# Altium schematic sheet LCD&Camera&Connectors.SchDoc: LCD & Camera & Connector
size A4; DocumentNumber: MB1167; Revision: B.1; SheetNumber: 6; SheetTotal: 17; Project: STM327x6G-EVAL
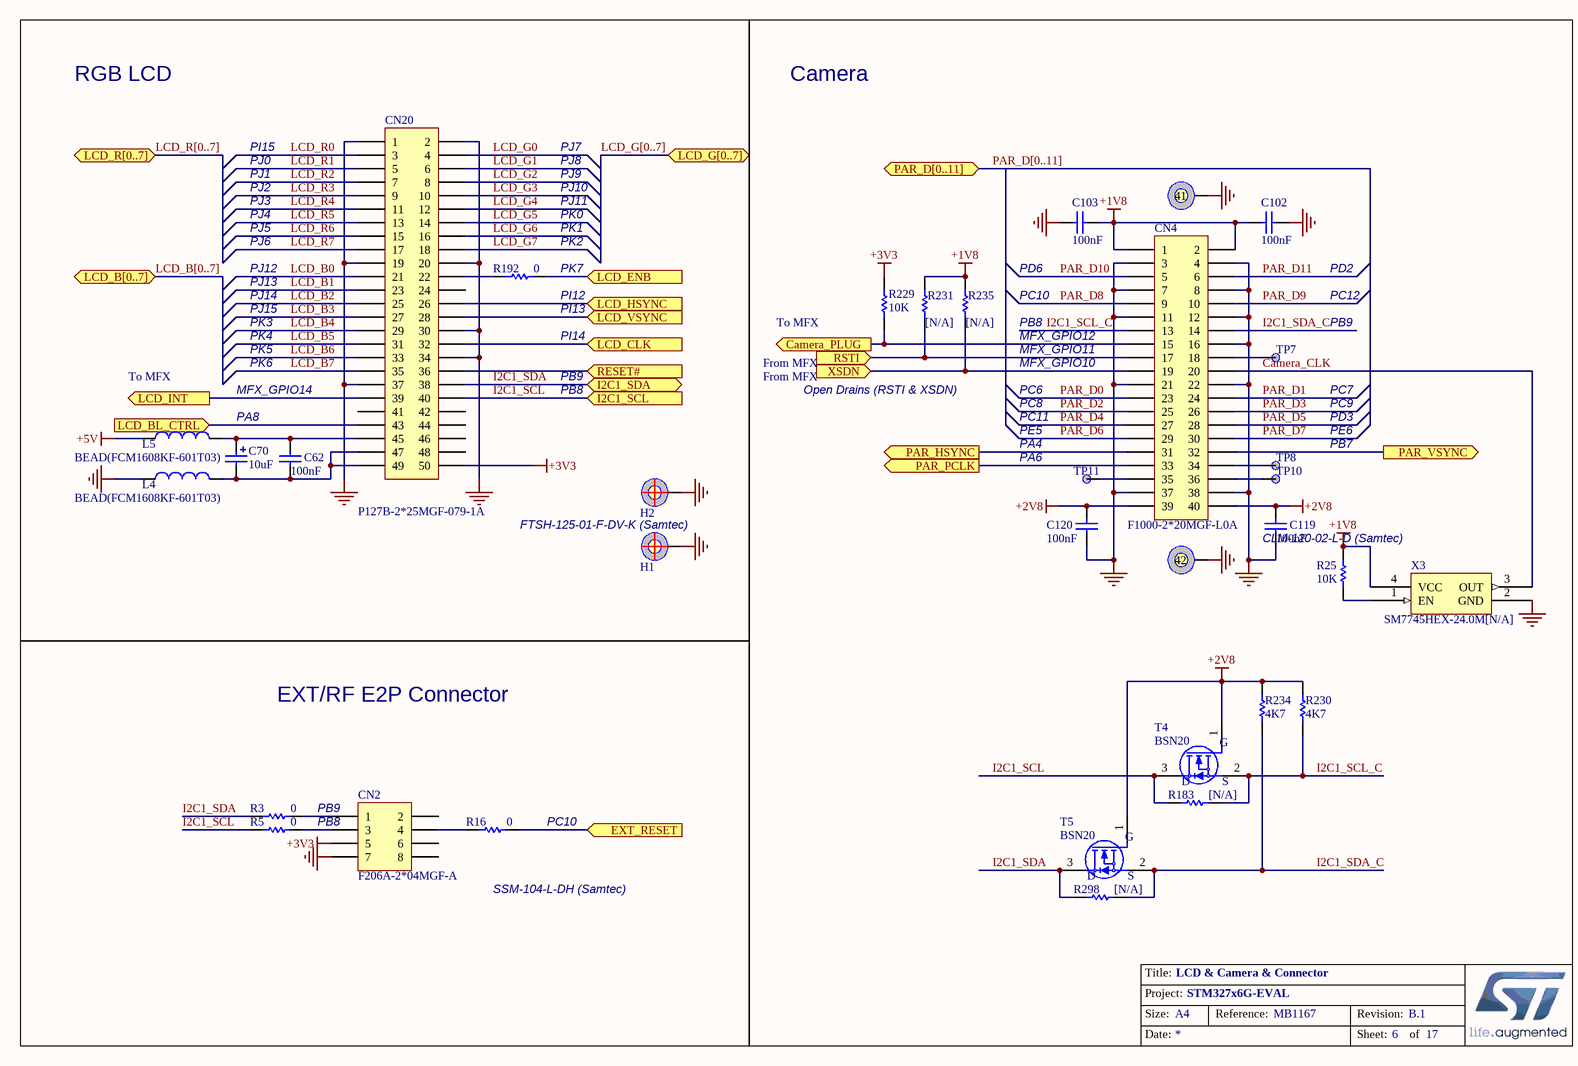
[diagram p0: LCD&Camera&Connectors.SchDoc]

## Parts
C62  100nF  [0603C]
C70  10uF  [TAN-A]
C102  100nF  [0603C]
C103  100nF  [0603C]
C119  100nF  [0603C]
C120  100nF  [0603C]
CN2  F206A-2*04MGF-A  [SSM-104-L-DH]
CN4  F1000-2*20MGF-L0A  [CLM-120-02-L-D]
CN20  P127B-2*25MGF-079-1A  [FTSH-125-01-F-DV]
H1  POSITION HOLE  [HOLE_C9D4R5]  (value not drawn)
H2  POSITION HOLE  [HOLE_C9D4R5]  (value not drawn)
L4  BEAD(FCM1608KF-601T03)  [0603L]
L5  BEAD(FCM1608KF-601T03)  [0603L]
R3  0  [0603R]
R5  0  [0603R]
R16  0  [0603R]
R25  10K  [0402R]
R183  [N/A]  [0603R]
R192  0  [0603R]
R229  10K  [0603R]
R230  4K7  [0603R]
R231  [N/A]  [0603R]
R234  4K7  [0603R]
R235  [N/A]  [0603R]
R298  [N/A]  [0603R]
T4  BSN20  [SOT-23]
T5  BSN20  [SOT-23]
TP7  (no value)  [TP]
TP8  (no value)  [TP]
TP10  (no value)  [TP]
TP11  (no value)  [TP]
X3  SM7745HEX-24.0M[N/A]  [OSC_4SM_7X5]

## Ports
Camera_PLUG (out), EXT_RESET (in), I2C1_SCL (in), I2C1_SDA (bidir), LCD_B[0..7] (bidir), LCD_BL_CTRL (in), LCD_CLK (in), LCD_ENB (in), LCD_G[0..7] (bidir), LCD_HSYNC (in), LCD_INT (out), LCD_R[0..7] (bidir), LCD_VSYNC (in), PAR_D[0..11] (bidir), PAR_HSYNC (out), PAR_PCLK (out), PAR_VSYNC (out), RESET# (in), RSTI (in), XSDN (in)

## Nets
+1V8: C102.1 C103.2 CN4.1 CN4.2 R25.2 R231.2 R235.2 X3.4(VCC)
+2V8: C119.1 C120.1 CN4.39 CN4.40 R230.2 R234.2 T4.1(G) T5.1(G)
+3V3: CN2.5 CN20.50 R229.1
+5V: L5.1
GND: C102.2 C103.1 C119.2 C120.2 CN2.7 CN4.3 CN4.4 CN4.7 CN4.8 CN4.11 CN4.12 CN4.16 CN4.21 CN4.22 CN4.37 CN4.38 CN4.41 CN4.42 CN20.1 CN20.2 CN20.19 CN20.20 CN20.30 CN20.34 CN20.37 H1.1 H2.1 L4.1 X3.2(GND)
Camera_CLK: CN4.20 X3.3(OUT)
Camera_PLUG: CN4.15 R229.2 ; port Camera_PLUG
EXT_RESET: R16.2 ; port EXT_RESET
I2C1_SCL: CN20.40 R5.1 R183.1 T4.3(D) ; port I2C1_SCL
I2C1_SCL_C: CN4.13 R183.2 R230.1 T4.2(S)
I2C1_SDA: CN20.38 R3.1 R298.1 T5.3(D) ; port I2C1_SDA
I2C1_SDA_C: CN4.14 R234.1 R298.2 T5.2(S)
LCD_B0: CN20.21
LCD_B1: CN20.23
LCD_B2: CN20.25
LCD_B3: CN20.27
LCD_B4: CN20.29
LCD_B5: CN20.31
LCD_B6: CN20.33
LCD_B7: CN20.35
LCD_BL_CTRL: CN20.43 ; port LCD_BL_CTRL
LCD_CLK: CN20.32 ; port LCD_CLK
LCD_ENB: R192.2 ; port LCD_ENB
LCD_G0: CN20.4
LCD_G1: CN20.6
LCD_G2: CN20.8
LCD_G3: CN20.10
LCD_G4: CN20.12
LCD_G5: CN20.14
LCD_G6: CN20.16
LCD_G7: CN20.18
LCD_HSYNC: CN20.26 ; port LCD_HSYNC
LCD_INT: CN20.39 ; port LCD_INT
LCD_R0: CN20.3
LCD_R1: CN20.5
LCD_R2: CN20.7
LCD_R3: CN20.9
LCD_R4: CN20.11
LCD_R5: CN20.13
LCD_R6: CN20.15
LCD_R7: CN20.17
LCD_VSYNC: CN20.28 ; port LCD_VSYNC
PAR_D0: CN4.23
PAR_D1: CN4.24
PAR_D2: CN4.25
PAR_D3: CN4.26
PAR_D4: CN4.27
PAR_D5: CN4.28
PAR_D6: CN4.29
PAR_D7: CN4.30
PAR_D8: CN4.9
PAR_D9: CN4.10
PAR_D10: CN4.5
PAR_D11: CN4.6
PAR_HSYNC: CN4.31 ; port PAR_HSYNC
PAR_PCLK: CN4.33 ; port PAR_PCLK
PAR_VSYNC: CN4.32 ; port PAR_VSYNC
RESET#: CN20.36 ; port RESET#
RSTI: CN4.17 R231.1 ; port RSTI
XSDN: CN4.19 R235.1 ; port XSDN
NetC62_1: C62.1 C70.1 CN20.45 L5.2
NetC62_2: C62.2 C70.2 CN20.47 CN20.49 L4.2
NetCN2_1: CN2.1 R3.2
NetCN2_3: CN2.3 R5.2
NetCN2_4: CN2.4 R16.1
NetCN4_18: CN4.18 TP7.1
NetCN4_34: CN4.34 TP8.1
NetCN4_35: CN4.35 TP11.1
NetCN4_36: CN4.36 TP10.1
NetCN20_22: CN20.22 R192.1
NetR25_1: R25.1 X3.1(EN)

Not connected (* = marked no-connect by the designer): CN2 2 6 8; CN20 24 41 42 44 46 48

## Buses and harness runs
bus LCD_B[0..7] = port LCD_B[0..7]
bus LCD_G[0..7] = port LCD_G[0..7]
bus LCD_R[0..7] = port LCD_R[0..7]
bus PAR_D[0..11] = port PAR_D[0..11]

## Notes on the sheet
- RGB LCD
- Camera
- PI15
- PJ0
- PJ1
- PJ2
- PJ7
- PJ8
- PJ9
- PJ10
- PJ3
- PJ4
- PJ5
- PJ6
- PJ11
- PK0
- (near R192) PK1
- (near R192) PK2
- PJ12
- PJ13
- PJ14
- PJ15
- PK3
- (near R192) PK7
- (near R192) PI12
- (near R192) PI13
- To MFX
- PC10
- PB8
- PD6
- PB9
- PD2
- PC12
- MFX_GPIO14
- PK4
- PK5
- PK6
- PI14
- From MFX
- Open Drains (RSTI & XSDN)
- PC6
- MFX_GPIO12
- MFX_GPIO10
- MFX_GPIO11
- PC7
- PA8
- PC11
- PE5
- PA4
- PA6
- PC8
- PE6
- PC9
- PB7
- PD3
- FTSH-125-01-F-DV-K (Samtec)
- (near CN4) CLM-120-02-L-D (Samtec)
- EXT/RF E2P Connector
- (near R16) PC10
- (near CN2) SSM-104-L-DH (Samtec)
- Title:
- Project:
- Size:
- Date:
- A4
- Reference:
- Sheet:
- Revision:
- of

## Library data of the parts
C62 C102 C103 C119 C120 = Cap: Capacitor; Value: 10nF; Published: 8-Jun-2000; Revision: July-2002: Re-released for DXP Platform.; Publisher: Altium Limited
C70 = Cap Pol1: Polarized Capacitor (Radial); Published: 8-Jun-2000; Revision: July-2002: Re-released for DXP Platform.; Publisher: Altium Limited; Value: 10uF
CN2 = SSM-104-L-DH: Header, 5-Pin, Dual row; Revision: 17-Jul-2002: Re-released for DXP Platform.; Publisher: Altium Limited
CN4 = CLM-120-02-L-D: Header, 20-Pin, Dual row; Revision: 17-Jul-2002: Re-released for DXP Platform.; Publisher: Altium Limited
CN20 = Header 25X2: Header, 26-Pin, Dual row; Revision: 17-Jul-2002: Re-released for DXP Platform.; Publisher: Altium Limited
L4 L5 = Inductor: Value: 100uH; Published: 8-Jun-2000; Revision: July-2002: Re-released for DXP Platform.; Publisher: Altium Limited
R3 R5 R16 R25 R183 R192 R229 R298 = Res1: Resistor; Value: 1K; Published: 8-Jun-2000; Revision: July-2002: Re-released for DXP Platform.; Publisher: Altium Limited
R230 R231 R234 R235 = res1: Resistor; Value: 1K; Published: 8-Jun-2000; Revision: July-2002: Re-released for DXP Platform.; Publisher: Altium Limited
T4 T5 = 2N7000
TP7 TP8 TP10 TP11 = TP
X3 = SM7745HEV-50.0M